# EAGLE design W076X (EAGLE 6.6.0)
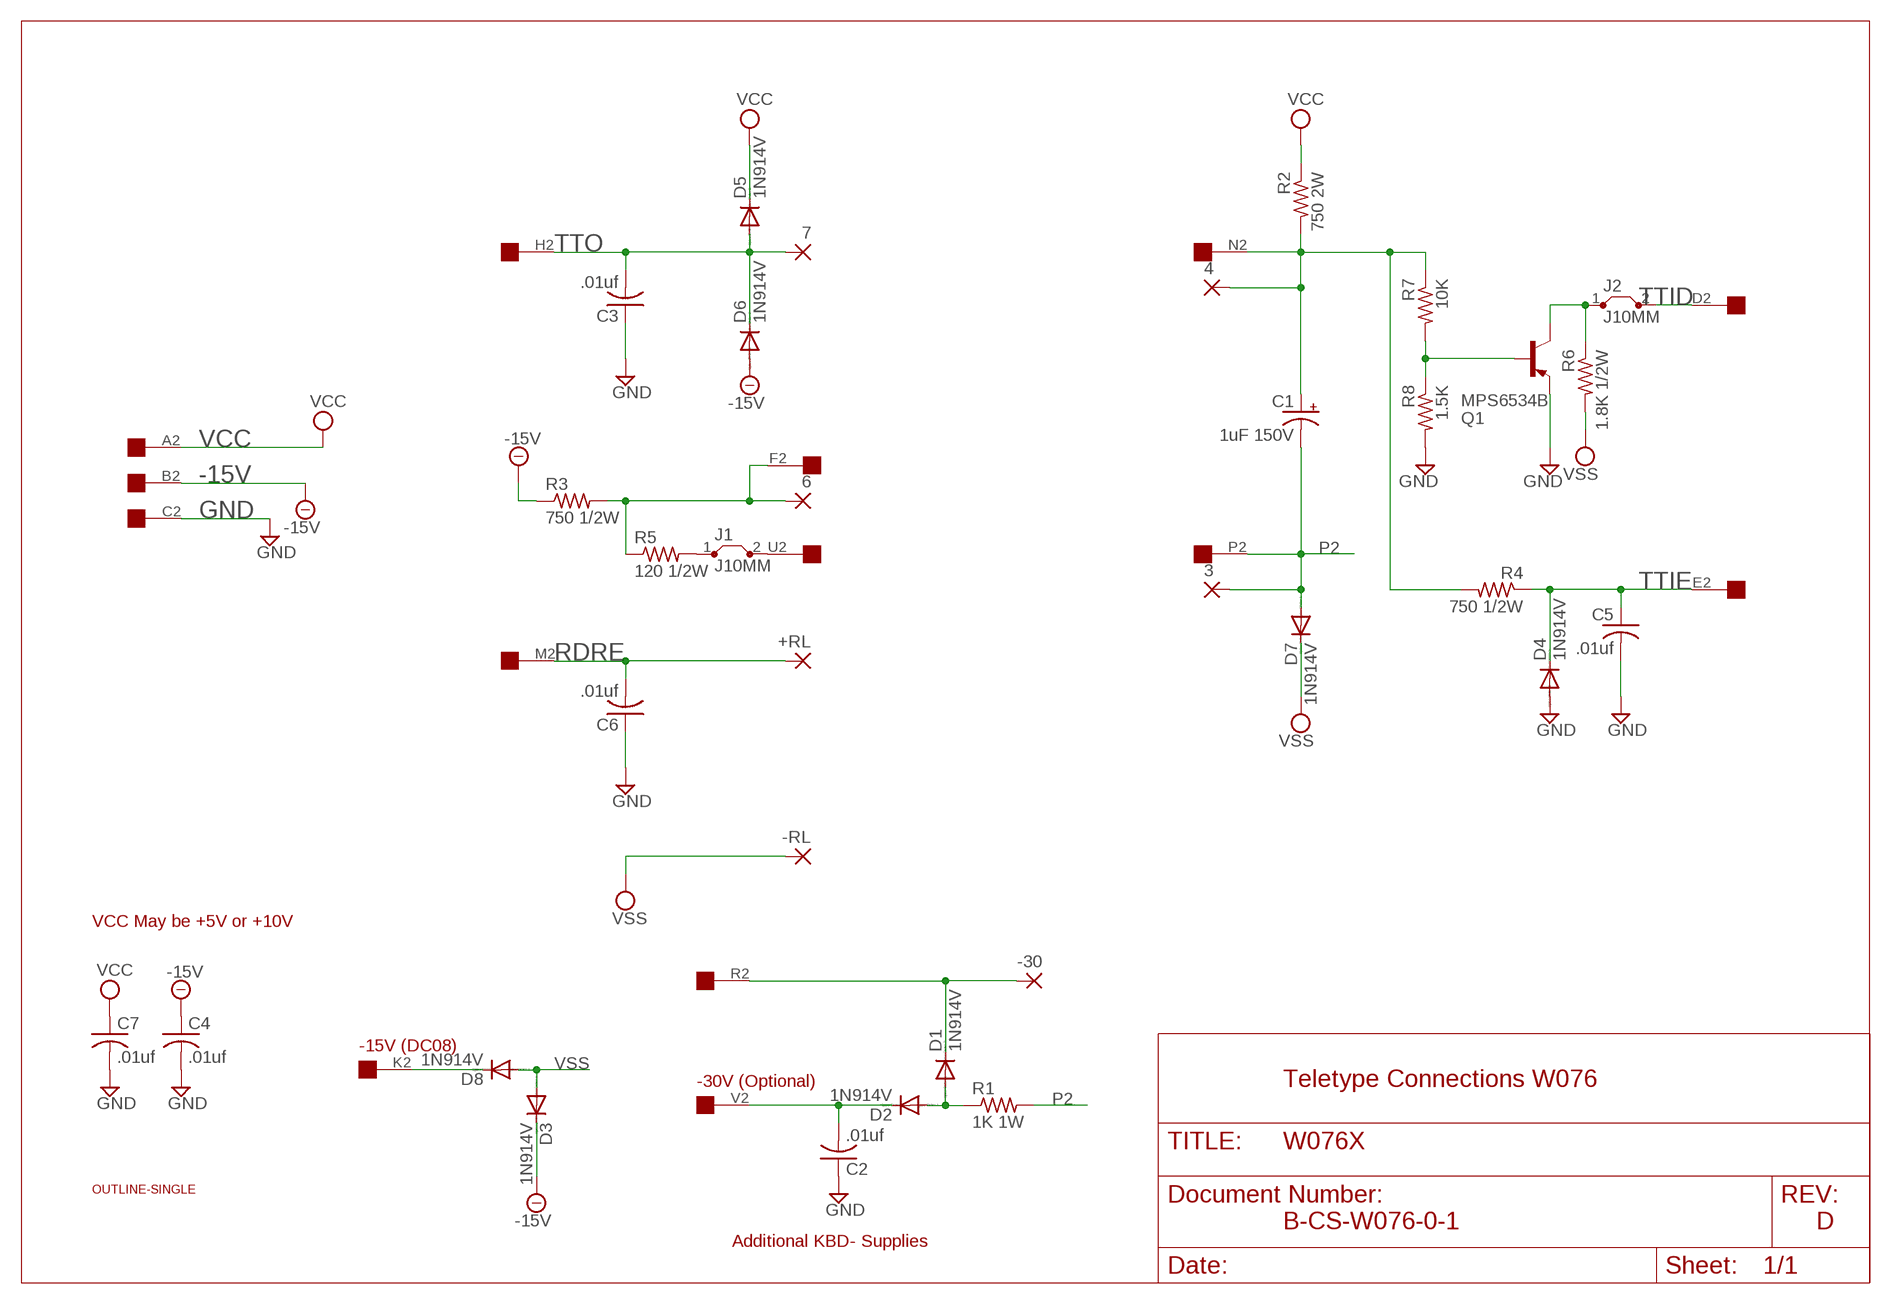
[diagram p0: schematic, sheet 1]

## Parts
3  2,54/1,0  [2,54/1,0]
4  2,54/1,0  [2,54/1,0]
6  2,54/1,0  [2,54/1,0]
7  2,54/1,0  [2,54/1,0]
+RL  2,54/1,0  [2,54/1,0]
-30  2,54/1,0  [2,54/1,0]
-RL  2,54/1,0  [2,54/1,0]
C1  1uF 150V  CPOL-USE25-9AXIAL  [E25-9]
C2  .01uf  C-US050-025X075  [C050-025X075]
C3  .01uf  C-US050-025X075  [C050-025X075]
C4  .01uf  C-US050-025X075  [C050-025X075]
C5  .01uf  C-US050-025X075  [C050-025X075]
C6  .01uf  C-US050-025X075  [C050-025X075]
C7  .01uf  C-US050-025X075  [C050-025X075]
D1  1N914V  1N4148DO35-10  [DO35-10]
D2  1N914V  1N4148DO35-10  [DO35-10]
D3  1N914V  1N4148DO35-10  [DO35-10]
D4  1N914V  1N4148DO35-10  [DO35-10]
D5  1N914V  1N4148DO35-10  [DO35-10]
D6  1N914V  1N4148DO35-10  [DO35-10]
D7  1N914V  1N4148DO35-10  [DO35-10]
D8  1N914V  1N4148DO35-10  [DO35-10]
EDGE  EDGE-1  [EDGE-CON1]
J1  J10MM  [10]
J2  J10MM  [10]
Q1  MPS6534B  2N2904  [TO39]
R1  1K 1W  R-US_0817/22  [P0817/22]
R2  750 2W  R-US_0817/22  [P0817/22]
R3  750 1/2W  R-US_0411/15  [0411/15]
R4  750 1/2W  R-US_0411/15  [0411/15]
R5  120 1/2W  R-US_0411/15  [0411/15]
R6  1.8K 1/2W  R-US_0411/15  [0411/15]
R7  10K  R-US_0207/10  [0207/10]
R8  1.5K  R-US_0207/10  [0207/10]
U$1  OUTLINE-SINGLE  [SINGLE]

## Nets
-15V: C4.1 D3.C D6.A EDGE.B2 R3.1
GND: C2.1 C3.1 C4.2 C5.2 C6.1 C7.2 D4.A EDGE.C2 Q1.1(E) R8.2
N$1: 6.1(P) EDGE.F2 R3.2 R5.1
N$2: Q1.2(B) R7.2 R8.1
N$3: -30.1(P) D1.C EDGE.R2
N$4: D8.C EDGE.K2
N$5: C2.2 D2.C EDGE.V2
N$6: D1.A D2.A R1.1
N$7: 4.1(P) C1.+ EDGE.N2 R2.2 R4.2 R7.1
N$8: J1.1 R5.2
N$9: J2.1 Q1.3(C) R6.1
P2: 3.1(P) C1.- D7.A EDGE.P2 R1.2
RDRE: +RL.1(P) C6.2 EDGE.M2
TTID: EDGE.D2 J2.2
TTIE: C5.1 D4.C EDGE.E2 R4.1
TTO: 7.1(P) C3.2 D5.A D6.C EDGE.H2
TTOE: EDGE.U2 J1.2
VCC: C7.1 D5.C EDGE.A2 R2.1
VSS: -RL.1(P) D3.A D7.C D8.A R6.2
Unconnected: EDGE.J2 EDGE.L2 EDGE.S2 EDGE.T2

## Notes on the sheet
- VCC May be +5V or +10V
- -15V (DC08)
- -30V (Optional) | Teletype Connections W076
- B-CS-W076-0-1 | D
- Additional KBD- Supplies

## Library data of the parts
3 4 6 7 +RL -30 -RL = wirepad:2,54/1,0: THROUGH-HOLE PAD
C1 = rcl:CPOL-US: POLARIZED CAPACITOR, American symbol
C2-C7 = rcl:C-US: CAPACITOR, American symbol
D1-D8 = diode:1N4148: DIODE high speed (Philips)
EDGE = dec-con:EDGE-1: Single-Sided DEC Edge Connector -- (side 2)
J1 J2 = jumper:J: Bridge
Q1 = transistor-pnp:2N2904*: PNP Transistror
R1-R8 = rcl:R-US_: RESISTOR, American symbol
U$1 = dec-con:OUTLINE-*: Board outlines for DEC boards.

## Board
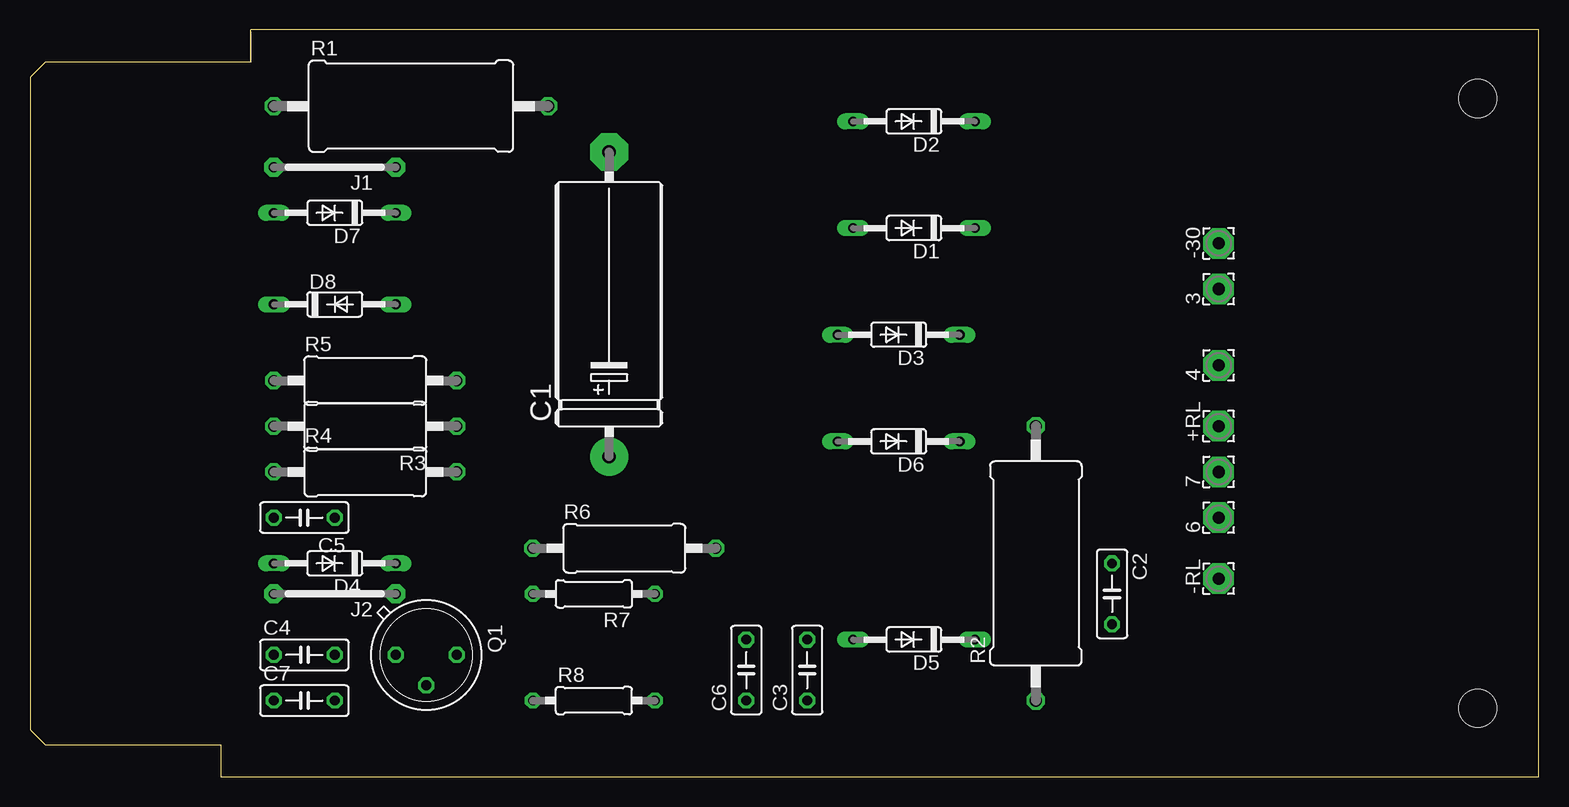
[diagram p1: board, top side]
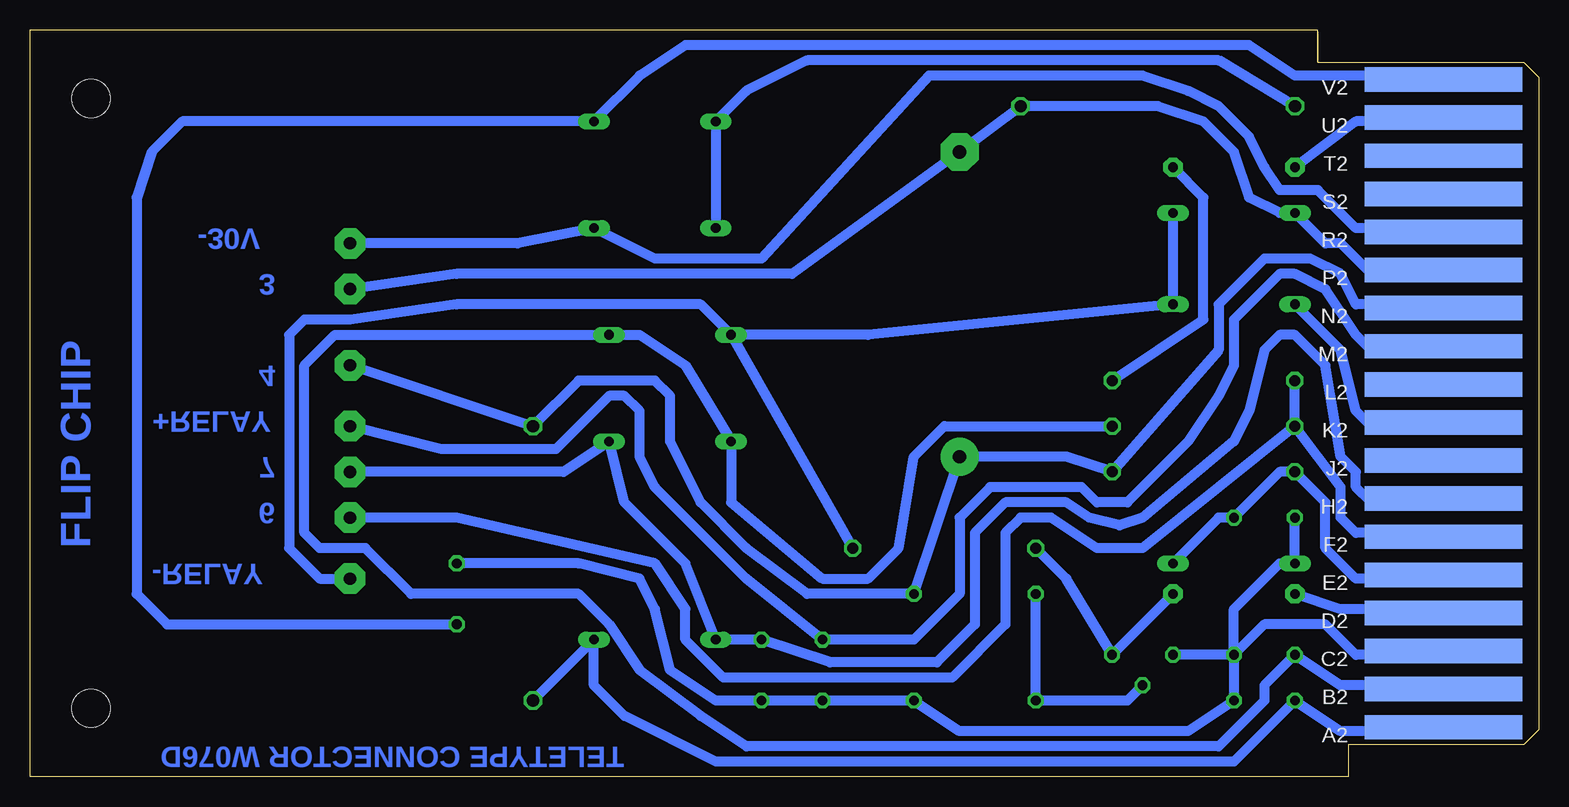
[diagram p2: board, bottom side, seen from below]

Size 125.73 x 62.23 mm. Coordinates in mm from the lower left corner, seen from the top.
Copper layers (1+16): Top 0.035mm / dielectric 1.5mm / Bottom 0.035mm
Design rules "16mils": minimum track width 16mil, minimum drill 32mil, track to track 15mil, track to pad 10mil, pad to pad 10mil, via to via 10mil, smd to smd 10mil, copper to edge 13mil, drill to drill 10mil, minimum pad ring 10mil, minimum via ring 8mil, stop-mask expansion 0mil, vias tented up to drill 0mil, thermal gap 10mil

### Footprints (pad centres in the part's own frame; a part is rotated, then mirrored left to right if it is on the bottom)
2,54/1,0 = drill 1.016 pad 2.54 octagon: 1 0,0
E25-9 = drill 1.118 pad 3.15: + -12.7,0 | drill 1.118 pad 3.15 octagon: - 12.7,0
C050-025X075 = drill 0.813 octagon: 1 -2.54,0; 2 2.54,0
DO35-10 = drill 0.813 long: A 5.08,0; C -5.08,0
EDGE-CON1 = smd 13.106 x 2.032 bottom: A2 7.938,4.128; B2 7.938,7.303; C2 7.938,10.477; D2 7.938,13.652; E2 7.938,16.828; F2 7.938,20.003; H2 7.938,23.177; J2 7.938,26.352; K2 7.938,29.527; L2 7.938,32.703; M2 7.938,35.877; N2 7.938,39.053; P2 7.938,42.227; R2 7.938,45.403; S2 7.938,48.578; T2 7.938,51.752; U2 7.938,54.928; V2 7.938,58.102
10 = drill 0.813 pad 1.6 octagon: 1 -5.08,0; 2 5.08,0
TO39 = drill 0.813 octagon: 1 0,-2.54; 2 2.54,0; 3 0,2.54
P0817/22 = drill 1.016 octagon: 1 -11.43,0; 2 11.43,0
0411/15 = drill 0.914 octagon: 1 -7.62,0; 2 7.62,0
0207/10 = drill 0.813 octagon: 1 -5.08,0; 2 5.08,0
SINGLE = hole 3.175: 120.65,56.515; 120.65,5.715

### Placement (x,y rotation side)
3  99.06,40.64 90 top
4  99.06,34.29 90 top
6  99.06,21.59 90 top
7  99.06,25.4 90 top
+RL  99.06,29.21 90 top
-30  99.06,44.45 90 top
-RL  99.06,16.51 90 top
C1  48.26,39.37 90 top
C2  90.17,15.24 270 top
C3  64.77,8.89 90 top
C4  22.86,10.16 0 top
C5  22.86,21.59 180 top
C6  59.69,8.89 90 top
C7  22.86,6.35 0 top
D1  73.66,45.72 180 top
D2  73.66,54.61 180 top
D3  72.39,36.83 180 top
D4  25.4,17.78 180 top
D5  73.66,11.43 180 top
D6  72.39,27.94 180 top
D7  25.4,46.99 180 top
D8  25.4,39.37 0 top
EDGE  0,0 0 top
J1  25.4,50.8 180 top
J2  25.4,15.24 180 top
Q1  33.02,10.16 270 top
R1  31.75,55.88 0 top
R2  83.82,17.78 90 top
R3  27.94,29.21 180 top
R4  27.94,25.4 0 top
R5  27.94,33.02 0 top
R6  49.53,19.05 0 top
R7  46.99,15.24 180 top
R8  46.99,6.35 0 top
U$1  0,0 0 top
U$2  [FLIPCHIP]  125.73,0 0 bottom

### Tracks (layer width: path | path; a pad name or v marks a point on that pad's centre or on a via)
-15V
  Bottom 0.813: EDGE.B2 8.26,7.62 16.51,7.62 C4.1 22.86,7.62 22.86,6.35 26.67,2.54 66.04,2.54 69.85,5.08 74.93,8.89 77.47,12.7 80.01,15.24 93.98,15.24 97.79,19.05 101.6,19.05 102.87,20.32 102.87,34.29 100.33,36.83 D3.C 74.93,36.83 71.12,34.29 D6.A 67.31,22.86 59.69,16.51 55.88,16.51 53.34,19.05 52.07,26.67 49.53,29.21 R3.1
GND
  Bottom 0.813: EDGE.C2 8.26,10.16 15.24,10.16 17.78,12.7 22.86,12.7 C4.2 | C4.2 C7.2 29.21,3.81 48.26,3.81 R8.2 C6.1 C3.1 68.58,6.35 72.39,8.89 73.66,13.97 74.93,16.51 80.01,17.78 C2.1 | C5.2 D4.A 21.59,17.78 25.4,13.97 C4.2 | C4.2 Q1.1
N$1
  Bottom 0.813: EDGE.F2 8.26,20.32 15.24,20.32 16.51,21.59 16.51,24.13 R3.2 | R3.2 R5.1 | R3.2 33.02,19.05 36.83,19.05 40.64,21.59 43.18,21.59 44.45,20.32 44.45,12.7 48.9,8.26 67.95,8.26 71.12,11.43 71.12,13.97 73.66,17.78 90.17,21.59 6.1
N$2
  Bottom 0.813: Q1.2 34.29,6.35 R8.1 R7.2
N$3
  Bottom 0.813: EDGE.R2 8.89,45.72 15.24,45.72 18.42,48.9 21.59,48.9 22.86,50.8 24.13,53.34 26.67,55.88 29.21,57.15 33.02,58.42 50.8,58.42 64.77,43.18 73.66,43.18 D1.C 85.09,44.45 -30.1
N$4
  Bottom 0.813: EDGE.K2 8.26,29.21 13.97,29.21 15.24,30.48 16.51,35.56 D8.C
N$5
  Bottom 0.813: EDGE.V2 8.89,58.42 20.32,58.42 24.13,60.96 71.12,60.96 74.93,58.42 D2.C 113.03,54.61 115.57,52.07 116.84,48.26 116.84,15.24 114.3,12.7 C2.2
N$6
  Bottom 0.813: R1.1 26.67,59.69 60.96,59.69 66.04,57.15 D2.A D1.A
N$7
  Bottom 0.813: EDGE.N2 8.89,39.37 15.24,39.37 16.51,41.91 19.05,43.18 22.86,43.18 26.67,39.37 26.67,35.56 R4.2 39.37,26.67 C1.+ R7.1 60.96,15.24 66.04,19.05 69.85,22.86 72.39,27.94 72.39,31.75 73.66,33.02 80.01,33.02 R2.2 4.1
N$8
  Bottom 0.813: J1.1 27.94,48.26 27.94,38.1 R5.2
N$9
  Bottom 0.813: J2.1 Q1.3 39.37,16.51 R6.1
P2
  Bottom 0.813: EDGE.P2 8.89,41.91 13.97,41.91 16.51,44.45 17.78,44.45 D7.A 21.59,46.99 24.13,48.26 25.4,52.07 27.94,54.61 31.75,55.88 R1.2 C1.- 62.23,41.91 90.17,41.91 3.1
RDRE
  Bottom 0.813: EDGE.M2 8.26,35.56 13.97,35.56 15.24,36.83 17.78,40.64 20.32,41.91 21.59,41.91 25.4,38.1 25.4,34.29 26.67,31.75 29.21,27.94 34.29,22.86 36.83,22.86 38.1,24.13 45.72,24.13 48.26,21.59 48.26,15.24 52.07,11.43 C6.2 66.04,16.51 73.66,24.13 74.93,26.67 74.93,30.48 76.2,31.75 77.47,31.75 81.92,27.3 91.44,27.3 +RL.1
TTID
  Bottom 0.813: EDGE.D2 8.26,13.97 16.51,13.97 J2.2
TTIE
  Bottom 0.813: EDGE.E2 8.26,16.51 15.24,16.51 17.78,19.05 17.78,22.86 R4.1 21.59,25.4 C5.1 26.67,21.59 D4.C
TTO
  Bottom 0.813: EDGE.H2 8.26,22.86 13.97,22.86 15.24,24.13 15.24,25.4 16.51,26.67 17.78,34.29 20.32,36.83 21.59,36.83 22.86,35.56 24.13,30.48 25.4,27.94 33.02,21.59 34.93,20.95 37.47,21.59 39.37,22.86 44.45,22.86 46.99,20.32 46.99,12.7 50.17,9.53 59.06,9.53 C3.2 D5.A 71.12,17.78 76.2,22.86 D6.C 81.28,25.4 7.1
TTOE
  Bottom 0.813: EDGE.U2 8.89,54.61 15.24,54.61 J1.2
VCC
  Bottom 0.813: EDGE.A2 8.26,3.81 16.51,3.81 C7.1 25.4,1.27 68.58,1.27 76.2,5.08 78.74,7.62 D5.C R2.1
VSS
  Bottom 0.813: D7.C D8.A 55.88,36.83 D3.A | D3.A R6.2 | D3.A 69.85,39.37 90.17,39.37 99.06,38.1 102.87,38.1 104.14,36.83 104.14,19.05 101.6,16.51 -RL.1

### Text on the board
Bottom: -30V | 3 | 4 | +RELAY | 7 | 6 | -RELAY | TELETYPE CONNECTOR W076D
200bmp: C:/Users/Vince/Documents/websvn/trunk/Eagle/projects/DEC/Wxxx/W076/W076Dback2fb.bmp